# Altium schematic sheet DP_TO_HDMI.SchDoc
size C; SheetNumber: 17; SheetTotal: 19
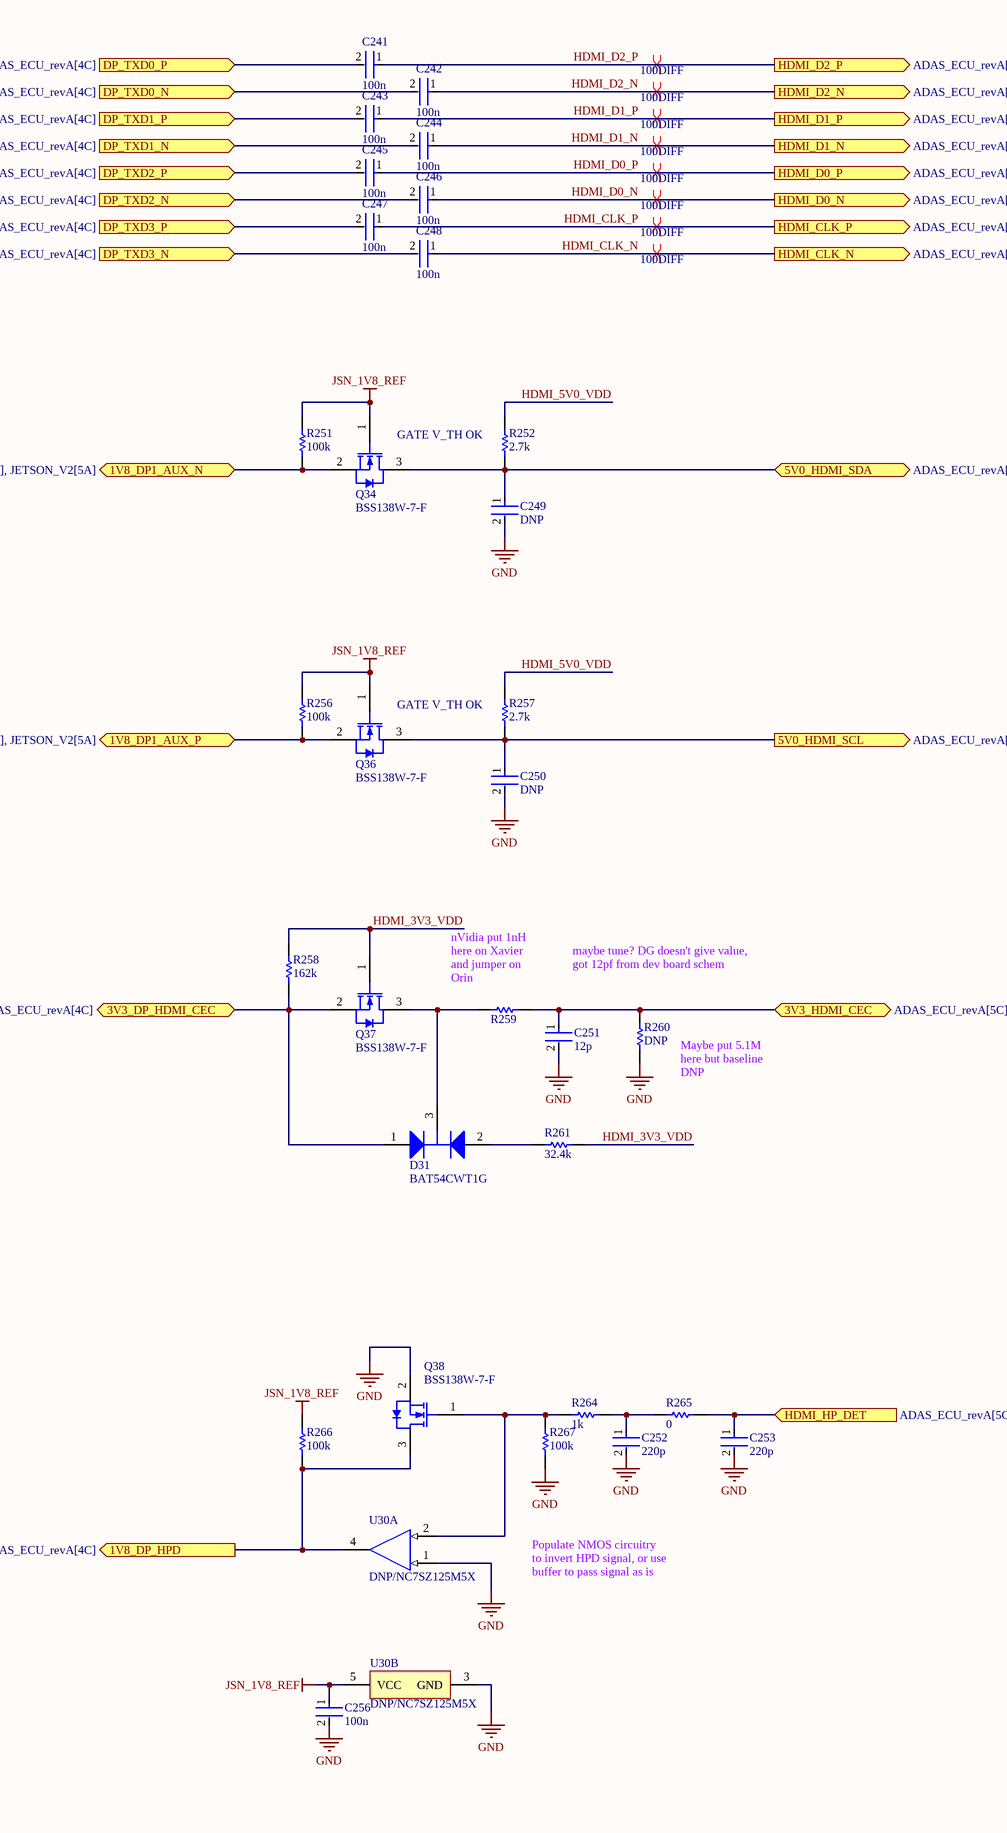
[diagram p0: DP_TO_HDMI.SchDoc, left]
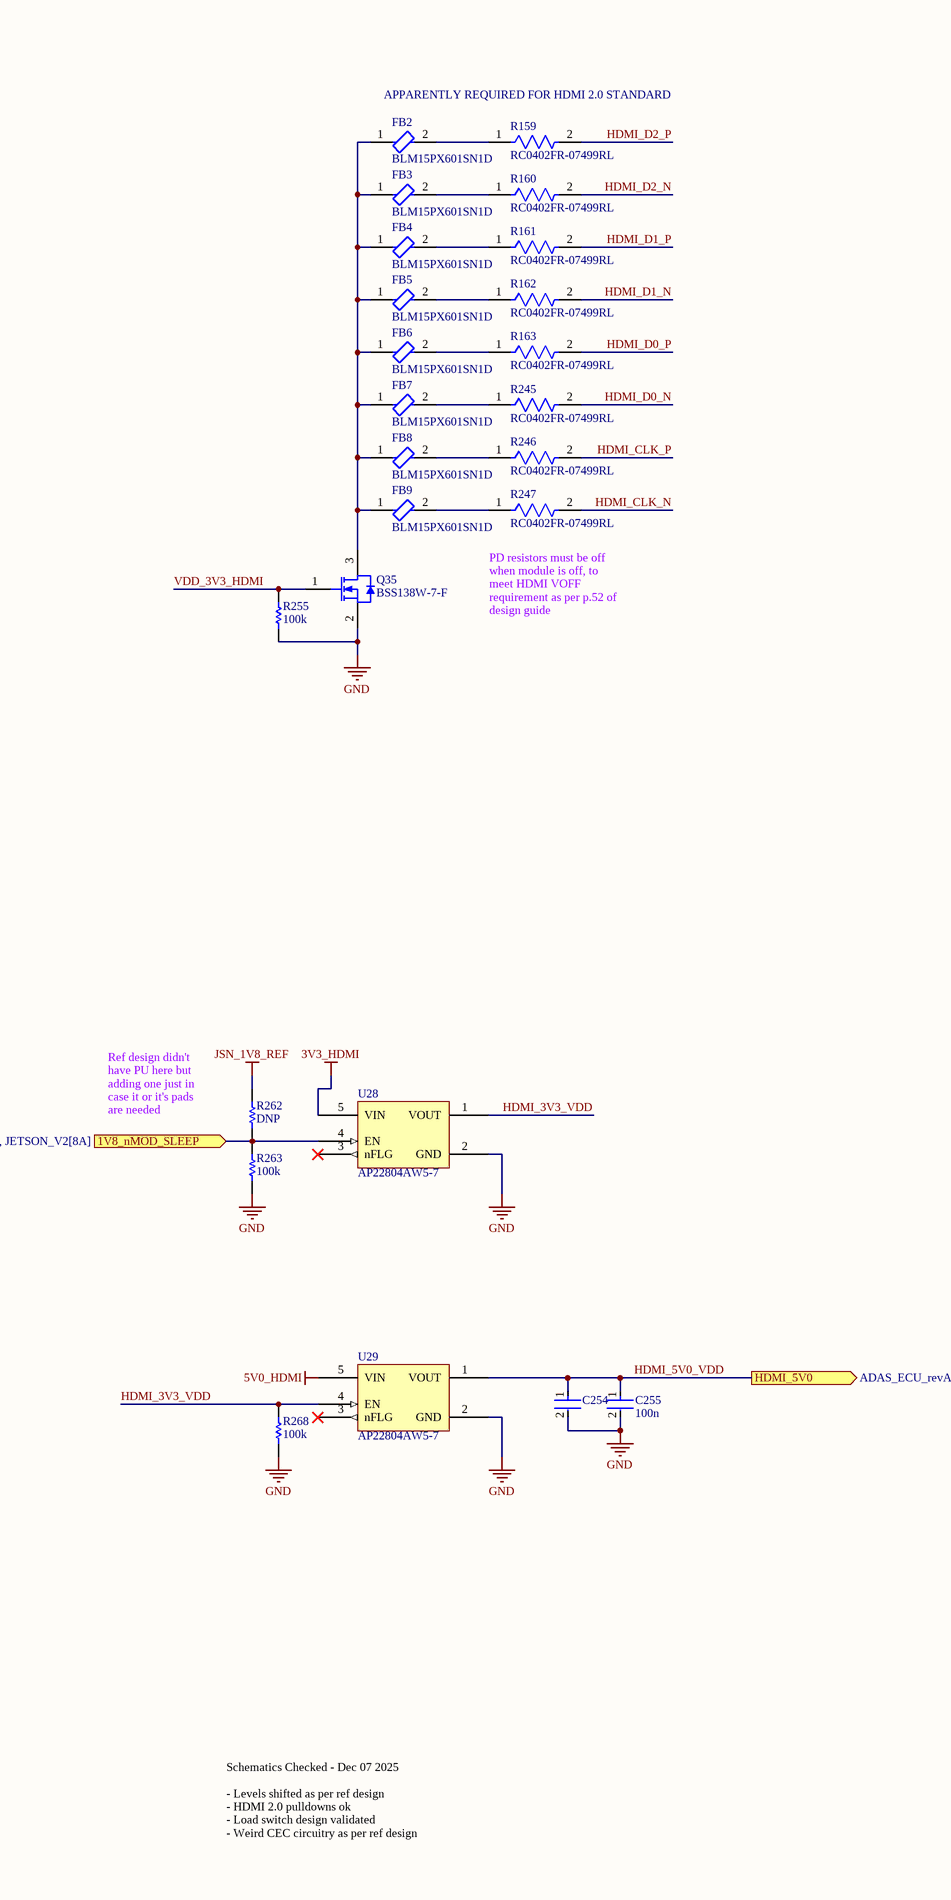
[diagram p1: DP_TO_HDMI.SchDoc, right]

## Parts
C241  100n  [FP-0402-L_1_0_0_05-W_0_5-IPC_A]
C242  100n  [FP-0402-L_1_0_0_05-W_0_5-IPC_A]
C243  100n  [FP-0402-L_1_0_0_05-W_0_5-IPC_A]
C244  100n  [FP-0402-L_1_0_0_05-W_0_5-IPC_A]
C245  100n  [FP-0402-L_1_0_0_05-W_0_5-IPC_A]
C246  100n  [FP-0402-L_1_0_0_05-W_0_5-IPC_A]
C247  100n  [FP-0402-L_1_0_0_05-W_0_5-IPC_A]
C248  100n  [FP-0402-L_1_0_0_05-W_0_5-IPC_A]
C249  DNP  [FP-0402-L_1_0_0_05-W_0_5-IPC_A]
C250  DNP  [FP-0402-L_1_0_0_05-W_0_5-IPC_A]
C251  12p  [FP-0402-L_1_0_0_05-W_0_5-IPC_A]
C252  220p  [FP-0402-L_1_0_0_05-W_0_5-IPC_A]
C253  220p  [FP-0402-L_1_0_0_05-W_0_5-IPC_A]
C254  DNP/GRM188R60J106ME47D  [FP-GRM188-0_1-e0_2_0_55-IPC_A]  (value not drawn)
C255  100n  [FP-0402-L_1_0_0_05-W_0_5-IPC_A]
C256  100n  [FP-0402-L_1_0_0_05-W_0_5-IPC_A]
D31  BAT54CWT1G  [ONSC-SOT-323-3-419-04_V]
FB2  BLM15PX601SN1D  [FP-BLM15-0_05-MFG]
FB3  BLM15PX601SN1D  [FP-BLM15-0_05-MFG]
FB4  BLM15PX601SN1D  [FP-BLM15-0_05-MFG]
FB5  BLM15PX601SN1D  [FP-BLM15-0_05-MFG]
FB6  BLM15PX601SN1D  [FP-BLM15-0_05-MFG]
FB7  BLM15PX601SN1D  [FP-BLM15-0_05-MFG]
FB8  BLM15PX601SN1D  [FP-BLM15-0_05-MFG]
FB9  BLM15PX601SN1D  [FP-BLM15-0_05-MFG]
Q34  BSS138W-7-F  [DIOD-SOT323-3_V]
Q35  BSS138W-7-F  [DIOD-SOT323-3_V]
Q36  BSS138W-7-F  [DIOD-SOT323-3_V]
Q37  BSS138W-7-F  [DIOD-SOT323-3_V]
Q38  BSS138W-7-F  [DIOD-SOT323-3_V]
R159  RC0402FR-07499RL  [FP-RC0402-0_4-IPC_A]
R160  RC0402FR-07499RL  [FP-RC0402-0_4-IPC_A]
R161  RC0402FR-07499RL  [FP-RC0402-0_4-IPC_A]
R162  RC0402FR-07499RL  [FP-RC0402-0_4-IPC_A]
R163  RC0402FR-07499RL  [FP-RC0402-0_4-IPC_A]
R245  RC0402FR-07499RL  [FP-RC0402-0_4-IPC_A]
R246  RC0402FR-07499RL  [FP-RC0402-0_4-IPC_A]
R247  RC0402FR-07499RL  [FP-RC0402-0_4-IPC_A]
R251  100k  [R0603B]
R252  2.7k  [R0603B]
R255  100k  [R0603B]
R256  100k  [R0603B]
R257  2.7k  [R0603B]
R258  162k  [R0603B]
R259  0402 JUMPER  [RESC1005X40X25ML05T05]  (value not drawn)
R260  DNP  [R0603B]
R261  32.4k  [R0603B]
R262  DNP  [R0603B]
R263  100k  [R0603B]
R264  1k  [R0603B]
R265  0  [R0603B]
R266  100k  [R0603B]
R267  100k  [R0603B]
R268  100k  [R0603B]
U28  AP22804AW5-7  [SOT95P285X140-5N]
U29  AP22804AW5-7  [SOT95P285X140-5N]
U30  DNP/NC7SZ125M5X  [FAIR-SOT23-5_V]  (parts A,B of 2)

## Ports
1V8_DP1_AUX_N (bidir, see ADAS_ECU_revA[4C], JETSON_V2[5A]), 1V8_DP1_AUX_P (bidir, see ADAS_ECU_revA[4C], JETSON_V2[5A]), 1V8_DP_HPD (out, see ADAS_ECU_revA[4C]), 1V8_nMOD_SLEEP (in, see ADAS_ECU_revA[4C], JETSON_V2[8A]), 3V3_DP_HDMI_CEC (bidir, see ADAS_ECU_revA[4C]), 3V3_HDMI_CEC (bidir, see ADAS_ECU_revA[5C]), 5V0_HDMI_SCL (out, see ADAS_ECU_revA[5C]), 5V0_HDMI_SDA (bidir, see ADAS_ECU_revA[5C]), DP_TXD0_N (in, see ADAS_ECU_revA[4C]), DP_TXD0_P (in, see ADAS_ECU_revA[4C]), DP_TXD1_N (in, see ADAS_ECU_revA[4C]), DP_TXD1_P (in, see ADAS_ECU_revA[4C]), DP_TXD2_N (in, see ADAS_ECU_revA[4C]), DP_TXD2_P (in, see ADAS_ECU_revA[4C]), DP_TXD3_N (in, see ADAS_ECU_revA[4C]), DP_TXD3_P (in, see ADAS_ECU_revA[4C]), HDMI_5V0 (out, see ADAS_ECU_revA[5C]), HDMI_CLK_N (out, see ADAS_ECU_revA[5C]), HDMI_CLK_P (out, see ADAS_ECU_revA[5C]), HDMI_D0_N (out, see ADAS_ECU_revA[5C]), HDMI_D0_P (out, see ADAS_ECU_revA[5C]), HDMI_D1_N (out, see ADAS_ECU_revA[5C]), HDMI_D1_P (out, see ADAS_ECU_revA[5C]), HDMI_D2_N (out, see ADAS_ECU_revA[5C]), HDMI_D2_P (out, see ADAS_ECU_revA[5C]), HDMI_HP_DET (in, see ADAS_ECU_revA[5C])

## Nets
3V3_HDMI: U28.5(VIN)
5V0_HDMI: U29.5(VIN)
GND: C249.2 C250.2 C251.2 C252.2 C253.2 C254.2 C255.2 C256.2 Q35.2(S) Q38.2(S) R255.1 R260.1 R263.1 R267.1 R268.1 U28.2(GND) U29.2(GND) U30.1(~{OE}) U30.3(GND)
JSN_1V8_REF: C256.1 Q34.1(G) Q36.1(G) R251.2 R256.2 R262.2 R266.2 U30.5(VCC)
1V8_DP1_AUX_N: Q34.2(S) R251.1 ; port 1V8_DP1_AUX_N
1V8_DP1_AUX_P: Q36.2(S) R256.1 ; port 1V8_DP1_AUX_P
1V8_DP_HPD: Q38.3(D) R266.1 U30.4(Y) ; port 1V8_DP_HPD
1V8_nMOD_SLEEP: R262.1 R263.2 U28.4(EN) ; port 1V8_nMOD_SLEEP
3V3_DP_HDMI_CEC: D31.1(A1) Q37.2(S) R258.2 ; port 3V3_DP_HDMI_CEC
3V3_HDMI_CEC: C251.1 R259.2 R260.2 ; port 3V3_HDMI_CEC
5V0_HDMI_SCL: C250.1 Q36.3(D) R257.1 ; port 5V0_HDMI_SCL
5V0_HDMI_SDA: C249.1 Q34.3(D) R252.1 ; port 5V0_HDMI_SDA
DP_TXD0_N: C242.2 ; port DP_TXD0_N
DP_TXD0_P: C241.2 ; port DP_TXD0_P
DP_TXD1_N: C244.2 ; port DP_TXD1_N
DP_TXD1_P: C243.2 ; port DP_TXD1_P
DP_TXD2_N: C246.2 ; port DP_TXD2_N
DP_TXD2_P: C245.2 ; port DP_TXD2_P
DP_TXD3_N: C248.2 ; port DP_TXD3_N
DP_TXD3_P: C247.2 ; port DP_TXD3_P
HDMI_3V3_VDD: Q37.1(G) R258.1 R261.1 R268.2 U28.1(VOUT) U29.4(EN)
HDMI_5V0_VDD: C254.1 C255.1 R252.2 R257.2 U29.1(VOUT) ; port HDMI_5V0
HDMI_CLK_N: C248.1 R247.2 ; port HDMI_CLK_N
HDMI_CLK_P: C247.1 R246.2 ; port HDMI_CLK_P
HDMI_D0_N: C246.1 R245.2 ; port HDMI_D0_N
HDMI_D0_P: C245.1 R163.2 ; port HDMI_D0_P
HDMI_D1_N: C244.1 R162.2 ; port HDMI_D1_N
HDMI_D1_P: C243.1 R161.2 ; port HDMI_D1_P
HDMI_D2_N: C242.1 R160.2 ; port HDMI_D2_N
HDMI_D2_P: C241.1 R159.2 ; port HDMI_D2_P
HDMI_HP_DET: C253.1 R265.1 ; port HDMI_HP_DET
VDD_3V3_HDMI: Q35.1(G) R255.2
NetC252_1: C252.1 R264.1 R265.2
NetD31_2: D31.2(A2) R261.2
NetD31_3: D31.3(K) Q37.3(D) R259.1
NetFB2_1: FB2.1 FB3.1 FB4.1 FB5.1 FB6.1 FB7.1 FB8.1 FB9.1 Q35.3(D)
NetFB2_2: FB2.2 R159.1
NetFB3_2: FB3.2 R160.1
NetFB4_2: FB4.2 R161.1
NetFB5_2: FB5.2 R162.1
NetFB6_2: FB6.2 R163.1
NetFB7_2: FB7.2 R245.1
NetFB8_2: FB8.2 R246.1
NetFB9_2: FB9.2 R247.1
NetQ38_1: Q38.1(G) R264.2 R267.2 U30.2(A)

Not connected (* = marked no-connect by the designer): U28 3(nFLG)*; U29 3(nFLG)*

## Layout directives
differential pair; differential pair class 100DIFF: HDMI_CLK_N, HDMI_CLK_P, HDMI_D0_N, HDMI_D0_P, HDMI_D1_N, HDMI_D1_P, HDMI_D2_N, HDMI_D2_P

## Notes on the sheet
- APPARENTLY REQUIRED FOR HDMI 2.0 STANDARD
- (near Q34) GATE V_TH OK
- (near R247) PD resistors must be off when module is off, to meet HDMI VOFF requirement as per p.52 of design guide
- (near Q36) GATE V_TH OK
- maybe tune? DG doesn't give value, got 12pf from dev board schem
- (near R259) nVidia put 1nH here on Xavier and jumper on Orin
- (near R260) Maybe put 5.1M here but baseline DNP
- Ref design didn't have PU here but adding one just in case it or it's pads are needed
- Populate NMOS circuitry to invert HPD signal, or use buffer to pass signal as is
- Schematics Checked - Dec 07 2025
  - Levels shifted as per ref design
  - HDMI 2.0 pulldowns ok
  - Load switch design validated
  - Weird CEC circuitry as per ref design

## Library data of the parts
C241-C253 C255 C256 = CMP-001-00058-1: LARGE PADS, 0402 CAP, CHANGE COMMENT TO MATCH REAL P/N; Capacitor Type: Ceramic; Min Operating Temperature: -55°C; Mounting Technology: Surface Mount; Pins: 2; Case/Package: 0402; RoHS Compliant: Yes; Max Operating Temperature: 85°C
C254 = CMP-2006-02792-2: Chip Multilayer Ceramic Capacitors for General Purpose, 0603, 10uF, X5R, 15%, 20%, 6.3V; Packaging: Tape and Reel; Voltage Rating (DC): 6.3V; Width: 0.031inch; Termination: SMD/SMT; Dielectric: X5R; Package Quantity: 4000; Voltage Rating: 6.3V; Capacitance: 10uF; Case/Package: 0603; Min Operating Temperature: -55°C; Voltage: 6.3V; Length: 1.6mm; Thickness: 0.035inch; Lead Free: Lead Free; Depth: 0.8mm; Case Code (Imperial): 0603; Max Operating Temperature: 85°C; Material: Ceramic; Height: 0.8mm; Tolerance: 20%; Mount: Surface Mount; REACH SVHC: No SVHC; Radiation Hardening: No; Case Code (Metric): 1608
D31 = CMP-1055-00557-1: Dual Series Cathode Schottky Barrier Diodes, 3-Pin SOT-323, Pb-Free, Tape and Reel; Manufacturer: On Semiconductor; Configuration: Common Cathode; IFSM Max (A): 0.6; trr Max (ns): 5; ComponentLink2Description: Datasheet; Packing: Tape and Reel; ComponentLink3Description: Package Specification; Mounting Technology: Surface Mount; PartNumber: BAT54CWT1G; PackageVersion: Rev. N, 11/2008; RoHS: TRUE; ComponentLink3URL: http://www.onsemi.com/pub_link/Collateral/419-04.PDF; ComponentLink2URL: http://www.onsemi.cn/pub_link/Collateral/BAT54CWT1-D.PDF; PackageReference: SOT-323-3-419-04; ComponentLink1URL: http://www.onsemi.com/; ComponentLink1Description: Manufacturer URL; DatasheetVersion: Rev. 7; PackageDescription: 3-Pin Small Outline Transistor, Body 2 x 1.25 mm, Pitch 0.65 mm
FB2-FB9 = CMP-0686-00252-4: Chip Ferrite Bead, 0402, 600Ω @ 100MHz, 0.23Ω, 25%, 900mA; Number of Circuits: 1; Impedance: 600R; DC Resistance (DCR): 230mR; Material: Steel; Length: 1mm; Package Quantity: 10000; Height: 0.5mm; Width: 0.5mm; Max DC Current: 900mA; Number of Lines: 1; Termination: SMD/SMT; Packaging: Tape and Reel; Lead Free: Lead Free; Min Operating Temperature: -55°C; Max Operating Temperature: 125°C; Max Current Rating: 900mA; Case Code (Imperial): 0402; Number of Pins: 2; Current Rating: 900mA; Test Frequency: 100MHz; Case/Package: 0402; Tolerance: 25%; Case Code (Metric): 1005
Q34-Q38 = CMP-2000-05968-1: N-Channel Enhancement Mode Mosfet, 50 V, 200 mA, -55 to 150 degC, 6-Pin SOT-323, RoHS, Tape and Reel; Typical Turn-Off Delay Time: 20ns; Number of Channels: 1Channel; Type: EnhancementModeFieldEffectTransistor; Brand: DiodesIncorporated; Vds - Drain-Source Breakdown Voltage: 75V; Vgs - Gate-Source Voltage: 20V; Rds On - Drain-Source Resistance: 1.4Ohms; Transistor Type: 1N-Channel; Configuration: Single; Unit Weight: 0.000212oz; Pd - Power Dissipation: 200mW; Id - Continuous Drain Current: 200mA; Forward Transconductance - Min: 0.1S; Manufacturer URL: http://www.diodes.com/; Series: BSS138; Package Description: 3-Pin Small Outline Transistor, Body 2 x 1.25 mm, Pitch 0.65 mm; Mounting Technology: SurfaceMount; Product Category: MOSFET; RoHS: True; Maximum Operating Temperature: +150C; Height: 1mm; Length: 2.2mm; Technology: Si; Width: 1.35mm; Datasheet URL: http://www.diodes.com/_files/datasheets/ds30206.pdf; Manufacturer: DiodesIncorporated; Package / Case: SOT-323-3; Typical Turn-On Delay Time: 20ns; Transistor Polarity: N-Channel; Factory Pack Quantity: 3000; Packaging: Reel; Product: MOSFETSmallSignal; Datasheet Version: Rev. 11-2, 09/2013; Package Reference: SOT323; Minimum Operating Temperature: -55C; Mounting Style: SMD/SMT; Channel Mode: Enhancement
R159-R163 R245-R247 = CMP-2002-07708-2: RES 499 OHM 1% 1/16W 0402; Power Rating: 62.5mW; Voltage Rating: 50V; Max Power Dissipation: 63mW; Temperature Coefficient: 100ppm/°C; Resistance: 499R; Width: 0.02inch; Resistance Tolerance: 1%; Package Quantity: 1; Military Standard: Not; Resistor Type: Thick Film; Height: 0.016inch; Features: Moisture Resistant; Lead Free: Lead Free; Case Code (Metric): 1005; Series: RC; REACH SVHC: No SVHC; Packaging: Tape and Reel; Depth: 0.5mm; Size Code: 0402; Min Operating Temperature: -55°C; Voltage Rating (DC): 50V; Max Operating Temperature: 155°C; Termination: SMD/SMT; Length: 0.039inch; RoHS Compliant: Yes; Case Code (Imperial): 0402; Construction: Rectangular; Number of Terminations: 2; Tolerance: 1%; Case/Package: 0402
R251 R252 R255-R258 R260-R268 = CMP-009-00002-14: Resistor
R259 = CMP-009-00118-2: READ THE NAME; Pins: 2; Component Type: Standard; Design Item ID: CMP-009-00206-2; Source: 0402jump.SchLib
U28 U29 = CMP-019-00060-1: SINGLE CHANNEL POWER DISTRIBUTION LOAD SWITCH, -40 to 85°C pF, RoHS; Max Supply Voltage: 5.5V; Min Supply Voltage: 2.7V; Max Operating Temperature: 85°C; Min Operating Temperature: -40°C
U30 = CMP-2000-06816-1: TinyLogic UHS Buffer with Three-State Output, 1.65 to 5.5 V, -40 to 85 degC, 5-Pin SOT23, RoHS, Tape and Reel; Manufacturer: Fairchild Semiconductor; Input Signal Type: Single-Ended; Maximum Operating Supply Voltage: 5.5V; Number of Outputs per Chip: 1; Maximum Propagation Delay Time @ Maximum CL: 5.7@3.3V; Minimum Operating Supply Voltage: 1.65V; Maximum Quiescent Current: 2uA; Propagation Delay Test Condition: 50pF; Lead Finish: MatteTin; Number of Output Enables per Chip: 1Low; Maximum Low Level Output Current: 32mA; Output Type: 3-State; Package Version: 08/2015; Max Processing Temp: 260; Maximum High Level Output Current: -32mA; Tolerant I/Os: 5V; Bus Hold: No; Fabrication Technology: CMOS; Polarity: Non-Inverting; Typical Operating Supply Voltage: 1.8; Logic Function: Buffer/LineDriver; Manufacturer URL: https://www.fairchildsemi.com/; Mounting: SurfaceMount; Number of Channels per Chip: 1; Package Description: 5-Pin Small Outline Transistor, Body 2.9 x 1.6 mm, Pitch 0.95 mm; Package Reference: SOT23-5; Number of Elements per Chip: 1; Package URL: https://www.fairchildsemi.com/package-drawings/MA/MA05B.pdf; Datasheet URL: https://www.fairchildsemi.com/datasheets/NC/NC7SZ125.pdf; Datasheet Version: Rev. 1.0.5, 01/2014; Mounting Technology: SurfaceMount; Operating Temperature: -40to85C; Number of Inputs per Chip: 1